# Altium project Lab_3_schematic.PrjPcb
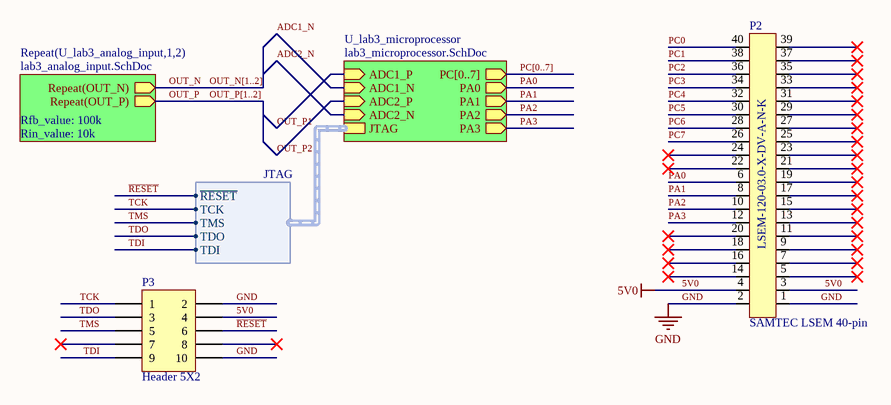
[diagram p0: lab3_schematic.SchDoc]
3 sheets, 24 parts. Net scope: hierarchical (ports join the sheet entries above them; power ports are global).
Board file: PCB2.PcbDoc
Sheets:
  lab3_schematic.SchDoc
    U_lab3_analog_input1 = lab3_analog_input.SchDoc
    U_lab3_analog_input2 = lab3_analog_input.SchDoc
    U_lab3_microprocessor = lab3_microprocessor.SchDoc

## Sheet lab3_schematic.SchDoc
size A4; Author: Michał Wojna; CompanyName: AGH; Revision: 1; SheetNumber: 1; SheetTotal: 3; SPICEModelCacheRHFFZEVK: <root> / <DocumentId>RHFFZEVK</DocumentId> / </root>

### Parts
P2  SAMTEC LSEM 40-pin  [LSEM-120-03.0-L-DV-A-N-K-TR]
P3  Header 5X2  [HDR2X5]

### Sub-sheets
Repeat(U_lab3_analog_input,1,2) = lab3_analog_input.SchDoc: Repeat(OUT_P) (out), Repeat(OUT_N) (out)  | Rfb_value: 100k; Rin_value: 10k
U_lab3_microprocessor = lab3_microprocessor.SchDoc: PC[0..7] (out), PA0 (out), PA1 (out), PA2 (out), PA3 (out), JTAG (harness JTAG), ADC2_P (in), ADC2_N (in), ADC1_N (in), ADC1_P (in)

### Harnesses
JTAG: ~{RESET}, TCK, TMS, TDO, TDI

### Nets
5V0: P2.3 P2.4 P3.4
GND: P2.1 P2.2 P3.2 P3.10
~{RESET}: P3.6 ; sheet U_lab3_microprocessor/JTAG.~{RESET}
OUT_N: sheet Repeat(U_lab3_analog_input,1,2)/Repeat(OUT_N)
OUT_P: sheet Repeat(U_lab3_analog_input,1,2)/Repeat(OUT_P)
PA0: P2.6 ; sheet U_lab3_microprocessor/PA0
PA1: P2.8 ; sheet U_lab3_microprocessor/PA1
PA2: P2.10 ; sheet U_lab3_microprocessor/PA2
PA3: P2.12 ; sheet U_lab3_microprocessor/PA3
PC0: P2.40
PC1: P2.38
PC2: P2.36
PC3: P2.34
PC4: P2.32
PC5: P2.30
PC6: P2.28
PC7: P2.26
TCK: P3.1 ; sheet U_lab3_microprocessor/JTAG.TCK
TDI: P3.9 ; sheet U_lab3_microprocessor/JTAG.TDI
TDO: P3.3 ; sheet U_lab3_microprocessor/JTAG.TDO
TMS: P3.5 ; sheet U_lab3_microprocessor/JTAG.TMS

Not connected (* = marked no-connect by the designer): P2 5(3)* 7(4)* 9(5)* 11(6)* 13(7)* 14(8)* 15(8)* 16(9)* 17(9)* 18(10)* 19(10)* 20(11)* 21(11)* 22(12)* 23(12)* 24(13)* 25(13)* 27(14)* 29(15)* 31(16)* 33(17)* 35(18)* 37(19)* 39(20)*; P3 7* 8*

### Buses and harness runs
bus OUT_N[1..2]
bus OUT_P[1..2]
bus PC[0..7] = sheet U_lab3_microprocessor/PC[0..7]

### Notes on the sheet
- Company Confidenrial / Not for distribution!
- Project name:
- Document Name:
- Designer Name:
- Date / Time:
- Revision:

### Library data of the parts
P2 = LSEM-120-03.0-X-DV-A-N-K: Manufacturer: SAMTEC; Part Number: LSEM-120-03.0-X-DV-A-N-K
P3 = Header 5X2: Header, 5-Pin, Dual row; LatestRevisionDate: 17-Jul-2002; LatestRevisionNote: Re-released for DXP Platform.; Publisher: Altium Limited

## Sheet lab3_analog_input.SchDoc
size A4; Author: Michał Wojna; CompanyName: AGH; Revision: 1; SheetNumber: 2; SheetTotal: 3
Used 2 times, as channels U_lab3_analog_input1, U_lab3_analog_input2. Parts and nets are listed once, with the designators drawn on the sheet.
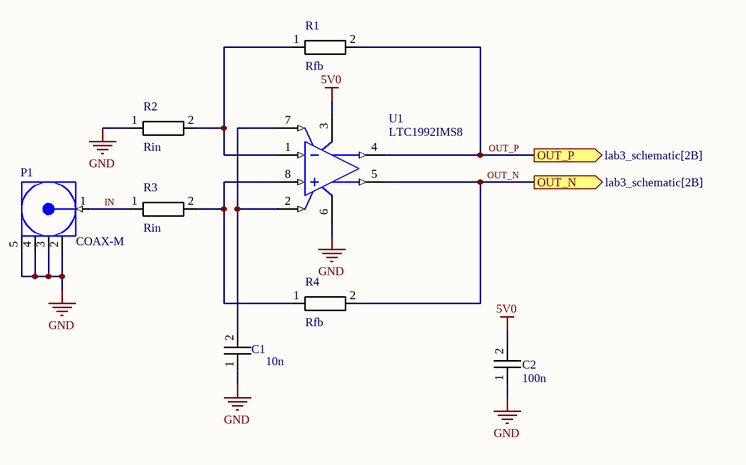
[diagram p1: lab3_analog_input.SchDoc]

### Parts
C1  10n  [0805_IPC]
C2  100n  [0805_IPC]
P1  COAX-M  [MMCX2.54-V5]
R1  Rfb  [0603]
R2  Rin  [0603]
R3  Rin  [0603]
R4  Rfb  [0603]
U1  LTC1992IMS8  [LT-MS8-8_L]

### Ports
OUT_N (out, see lab3_schematic[2B]), OUT_P (out, see lab3_schematic[2B])

### Nets
5V0: C2.2(PIN) U1.3(+VS)
GND: C1.1(PIN) C2.1(PIN) P1.2(GND) P1.3(GND) P1.4(GND) P1.5(GND) R2.1(PIN) U1.6(-VS)
IN: P1.1(Signal) R3.1(PIN)
OUT_N: R4.2(PIN) U1.5(-OUT) ; port OUT_N
OUT_P: R1.2(PIN) U1.4(+OUT) ; port OUT_P
NetC1_2: C1.2(PIN) U1.2(VOCM) U1.7(VMID)
NetR1_1: R1.1(PIN) R2.2(PIN) U1.1(-IN)
NetR3_2: R3.2(PIN) R4.1(PIN) U1.8(+IN)

### Channels
U_lab3_analog_input1: designators end in _U_lab3_analog_input1; ports OUT_N=OUT_N_U_lab3_analog_input1 OUT_P=ADC1_P
U_lab3_analog_input2: designators end in _U_lab3_analog_input2; ports OUT_N=OUT_N_U_lab3_analog_input2 OUT_P=ADC2_P

### Notes on the sheet
- Company Confidenrial / Not for distribution!
- Project name:
- Document Name:
- Designer Name:
- Date / Time:
- Revision:

### Library data of the parts
C1 C2 = Capacitor: Manufacturer: *; Part Number: *
  C1: Value: 10n
  C2: Value: 100n
P1 = COAX-M: RF Coaxial PCB Connector, MMCX; Thru-Hole, Vertical Mount Plug,  50 Ohm Impedance; PackageDocument: Rev. A, 16-Jun-1997; PCB_Layout: Complies with manufacturer's recommendation.; DrillSize: Corresponds to nominal value.; Published: 15-Jul-2004; LatestRevisionDate: 15-Jul-2004; LatestRevisionNote: Component Replaced.; DatasheetDocument: 30-May-2003; PackageReference: 908-21103; Publisher: Altium Limited; ComponentLink1Description: Manufacturer Link; ComponentLink1URL: http://www.amphenolrf.com/
R1-R4 = Resistor: Manufacturer: *; Part Number: *
  R1 R4: Value: Rfb
  R2 R3: Value: Rin
U1 = CMP-0359-00506-2: Single Channel, Low Power, Fully Differential Input / Output Amplifier / Driver, 4 MHz Typical GBW, 0.75 V/us Typical SR, 2.4 to 12 V, 8-Pin SOP (MS8-8), Industrial; Manufacturer: Linear Technology; Is (mA) Typical: 0.65; Vs Min (V): 2.4; SR (V/us) Typical: 0.75; Vos (mV) Typical: 0.25; Vs Max (V): 12; Channels (#): 1; GBW (MHz) Typical: 4; ComponentLink3URL: http://cds.linear.com/docs/en/packaging/05081610_G_SO8.pdf; Linear Technology Part Number: LTC1992; PackageDescription: 8-Lead Plastic Small Outline, Body 3.9 x 4.9 mm, Pitch 1.27 mm; Type: DIFF; ComponentLink1URL: http://www.linear.com/; ComponentLink2Description: Datasheet; PartNumber: LTC1992IMS8; DatasheetVersion: Rev. A; ComponentLink3Description: Package Specification; Mounting Technology: Surface Mount; ComponentLink2URL: http://cds.linear.com/docs/en/datasheet/1992fb.pdf; RevisionNote: URLs updated; PackageReference: LT-MS8-8; ComponentLink1Description: Manufacturer URL; PackageVersion: Rev G

## Sheet lab3_microprocessor.SchDoc
size A4; Author: Michał Wojna; CompanyName: AGH; Revision: 1; SheetNumber: 3; SheetTotal: 2
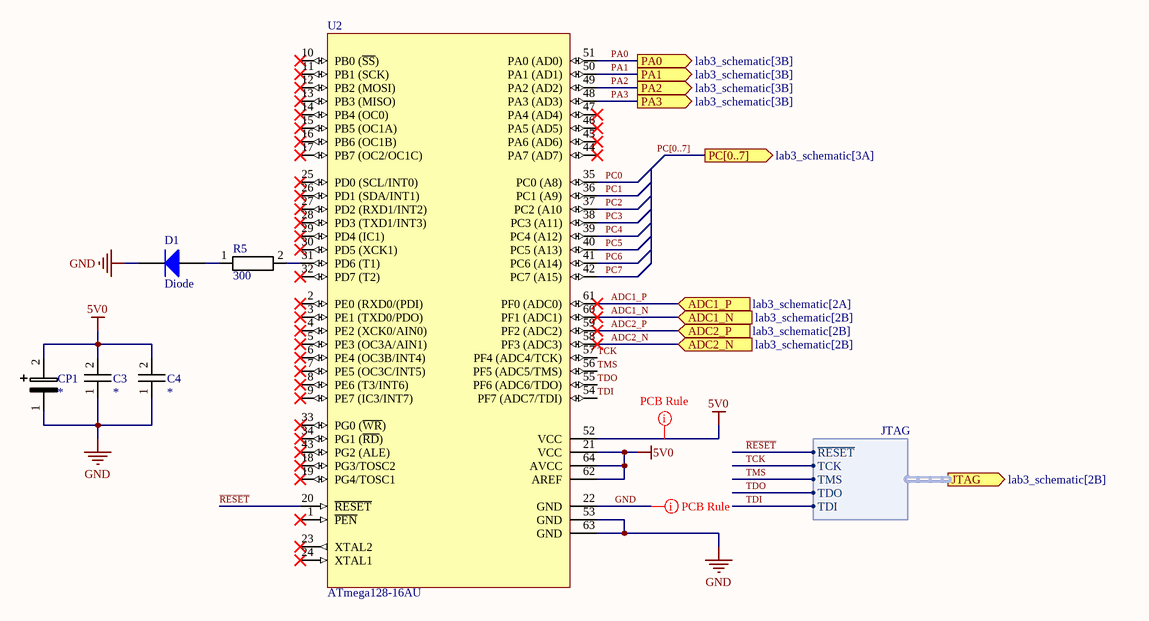
[diagram p2: lab3_microprocessor.SchDoc]

### Parts
C3  *  [0805_STD]
C4  *  [0805_STD]
CP1  *  [VJ_Tantalum_D]
D1  Diode  [SMC]
R5  300  [0603]
U2  ATmega128-16AU  [64A_M]

### Ports
ADC1_N (in, see lab3_schematic[2B]), ADC1_P (in, see lab3_schematic[2A]), ADC2_N (in, see lab3_schematic[2B]), ADC2_P (in, see lab3_schematic[2B]), JTAG (out, harness JTAG, see lab3_schematic[2B]), PA0 (out, see lab3_schematic[3B]), PA1 (out, see lab3_schematic[3B]), PA2 (out, see lab3_schematic[3B]), PA3 (out, see lab3_schematic[3B]), PC[0..7] (out, see lab3_schematic[3A])

### Harnesses
JTAG: ~{RESET}, TCK, TMS, TDO, TDI

### Nets
5V0: C3.2(PIN) C4.2(PIN) CP1.2(PIN) U2.21(VCC) U2.52(VCC) U2.62(AREF) U2.64(AVCC)
GND: C3.1(PIN) C4.1(PIN) CP1.1(PIN) D1.2(K) U2.22(GND) U2.53(GND) U2.63(GND)
~{RESET}: U2.20(~{RESET}) ; port JTAG.~{RESET}
ADC1_N: U2.60(PF1_(ADC1)) ; port ADC1_N
ADC1_P: U2.61(PF0_(ADC0)) ; port ADC1_P
ADC2_N: U2.58(PF3_(ADC3)) ; port ADC2_N
ADC2_P: U2.59(PF2_(ADC2)) ; port ADC2_P
PA0: U2.51(PA0_(AD0)) ; port PA0
PA1: U2.50(PA1_(AD1)) ; port PA1
PA2: U2.49(PA2_(AD2)) ; port PA2
PA3: U2.48(PA3_(AD3)) ; port PA3
PC0: U2.35(PC0_(A8))
PC1: U2.36(PC1_(A9))
PC2: U2.37(PC2_(A10)
PC3: U2.38(PC3_(A11))
PC4: U2.39(PC4_(A12))
PC5: U2.40(PC5_(A13))
PC6: U2.41(PC6_(A14))
PC7: U2.42(PC7_(A15))
TCK: U2.57(PF4_(ADC4/TCK)) ; port JTAG.TCK
TDI: U2.54(PF7_(ADC7/TDI)) ; port JTAG.TDI
TDO: U2.55(PF6_(ADC6/TDO)) ; port JTAG.TDO
TMS: U2.56(PF5_(ADC5/TMS)) ; port JTAG.TMS
NetD1_1: D1.1(A) R5.1(PIN)
NetR5_2: R5.2(PIN) U2.31(PD6_(T1))

Not connected (* = marked no-connect by the designer): U2 1(~{PEN})* 2(PE0_(RXD0/(PDI))* 3(PE1_(TXD0/PDO))* 4(PE2_(XCK0/AIN0))* 5(PE3_(OC3A/AIN1))* 6(PE4_(OC3B/INT4))* 7(PE5_(OC3C/INT5))* 8(PE6_(T3/INT6))* 9(PE7_(IC3/INT7))* 10(PB0_(~{SS}))* 11(PB1_(SCK))* 12(PB2_(MOSI))* 13(PB3_(MISO))* 14(PB4_(OC0))* 15(PB5_(OC1A))* 16(PB6_(OC1B))* 17(PB7_(OC2/OC1C))* 18(PG3/TOSC2)* 19(PG4/TOSC1)* 23(XTAL2)* 24(XTAL1)* 25(PD0_(SCL/INT0))* 26(PD1_(SDA/INT1))* 27(PD2_(RXD1/INT2))* 28(PD3_(TXD1/INT3))* 29(PD4_(IC1))* 30(PD5_(XCK1))* 32(PD7_(T2))* 33(PG0_(~{WR}))* 34(PG1_(~{RD}))* 43(PG2_(ALE))* 44(PA7_(AD7))* 45(PA6_(AD6))* 46(PA5_(AD5))* 47(PA4_(AD4))*

### Buses and harness runs
bus PC[0..7] = port PC[0..7]

### Layout directives
rule Width Constraint [Pref Width = 20mil    Min Width = 15mil    Max Width = 50mil]: 5V0, GND

### Notes on the sheet
- Company Confidenrial / Not for distribution!
- Project name:
- Document Name:
- Designer Name:
- Date / Time:
- Revision:

### Library data of the parts
C3 C4 = Capacitor: Manufacturer: *; Part Number: *; Value: *
CP1 = Capacitor_polarized: Manufacturer: *; Part Number: *; Value: *
D1 = Diode: Default Diode; Published: 8-Jun-2000; LatestRevisionDate: 17-Jul-2002; LatestRevisionNote: Re-released for DXP Platform.; PackageVersion: Sep-1996; PackageReference: SMC; Publisher: Altium Limited; PackageDescription: DO-214-AB/SMC; 2 C-Bend Leads; Body 7.9 x 5.9 mm, inc. leads (LxW); Code_JEDEC: DO-214-AB
R5 = Resistor: Manufacturer: *; Part Number: *; Value: 300
U2 = CMP-0095-00259-2: 8-bit AVR Microcontroller, 4.5-5.5V, 128KB Flash, 4KB EEPROM, 4KB SRAM, 64-pin TQFP, Industrial Grade (-40°C to 85°C); ComponentLink3URL: http://www.atmel.com/dyn/resources/prod_documents/2467S.pdf; PackageVersion: revC, Oct-2010; ComponentLink2URL: http://www.atmel.com/dyn/resources/prod_documents/doc2467.pdf; ComponentLink2Description: ATmega128(L) Datasheet; ComponentLink1Description: Manufacturer URL; PackageReference: 64A; DatasheetVersion: revX, Jun-2011; ComponentLink3Description: ATmega128(L) Summary; ComponentLink1URL: http://www.atmel.com/; RevisionNote: PackageVersion updated. URLs added.; Code_JEDEC: MS-026-AEB; PackageDescription: 64-Pin Plastic Thin Profile Quad Flat Pack, 14 x 14 x 1.0 mm Body, 0.8 mm Pitch (TQFP)

## Nets that join several sheets
5V0: lab3_schematic (P2.3 P2.4 P3.4), U_lab3_analog_input1 (C2_U_lab3_analog_input1.2 U1_U_lab3_analog_input1.3), U_lab3_analog_input2 (C2_U_lab3_analog_input2.2 U1_U_lab3_analog_input2.3), lab3_microprocessor (7 pins)
GND: lab3_schematic (P2.1 P2.2 P3.2 P3.10), U_lab3_analog_input1 (8 pins), U_lab3_analog_input2 (8 pins), lab3_microprocessor (7 pins)
~{RESET}: lab3_schematic (P3.6), lab3_microprocessor (U2.20)
ADC1_P: U_lab3_analog_input1 (R1_U_lab3_analog_input1.2 U1_U_lab3_analog_input1.4), lab3_microprocessor (U2.61)
ADC2_P: U_lab3_analog_input2 (R1_U_lab3_analog_input2.2 U1_U_lab3_analog_input2.4), lab3_microprocessor (U2.59)
PA0: lab3_schematic (P2.6), lab3_microprocessor (U2.51)
PA1: lab3_schematic (P2.8), lab3_microprocessor (U2.50)
PA2: lab3_schematic (P2.10), lab3_microprocessor (U2.49)
PA3: lab3_schematic (P2.12), lab3_microprocessor (U2.48)
PC0: lab3_schematic (P2.40), lab3_microprocessor (U2.35)
PC1: lab3_schematic (P2.38), lab3_microprocessor (U2.36)
PC2: lab3_schematic (P2.36), lab3_microprocessor (U2.37)
PC3: lab3_schematic (P2.34), lab3_microprocessor (U2.38)
PC4: lab3_schematic (P2.32), lab3_microprocessor (U2.39)
PC5: lab3_schematic (P2.30), lab3_microprocessor (U2.40)
PC6: lab3_schematic (P2.28), lab3_microprocessor (U2.41)
PC7: lab3_schematic (P2.26), lab3_microprocessor (U2.42)
TCK: lab3_schematic (P3.1), lab3_microprocessor (U2.57)
TDI: lab3_schematic (P3.9), lab3_microprocessor (U2.54)
TDO: lab3_schematic (P3.3), lab3_microprocessor (U2.55)
TMS: lab3_schematic (P3.5), lab3_microprocessor (U2.56)